# Altium project Breathalyzer.PrjPCB (part 2 of 2)
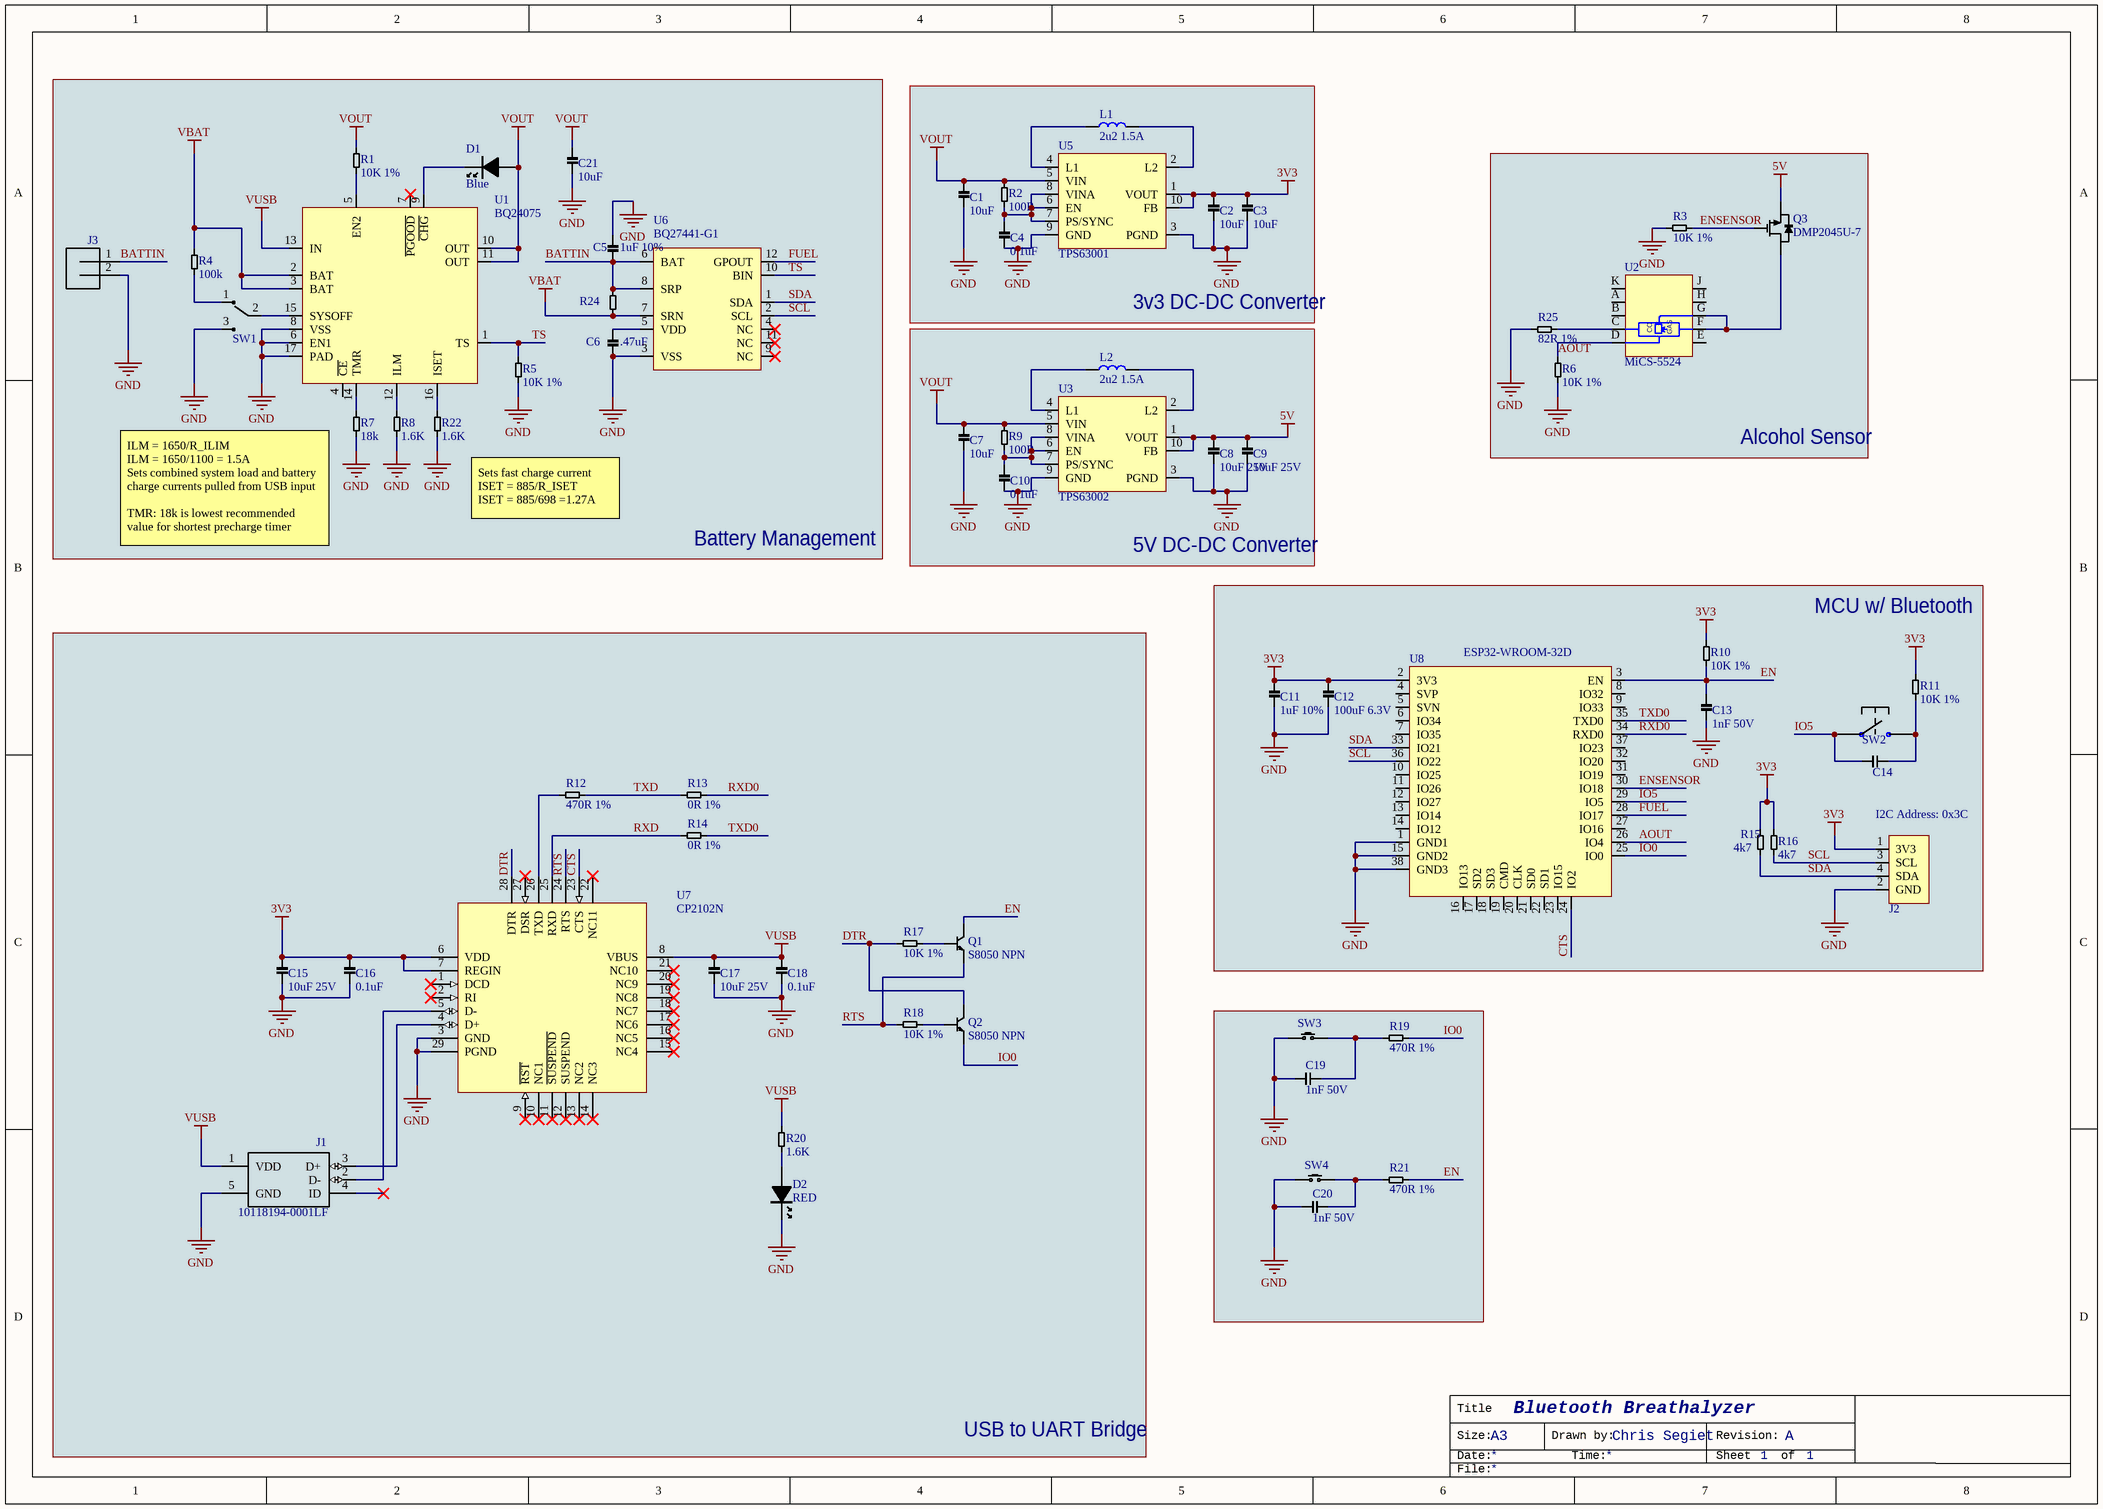
[diagram p1: Breathalyzer.SchDoc]

## Sheet Breathalyzer.SchDoc: Bluetooth Breathalyzer (continued)

### Library data of the parts
C1-C3 C7 C21 = 08056C106KAT2A: CAP CER 10UF 6.3V X7R 0805; Manufacturer: Kyocera AVX; Tolerance: 10%; Supplier 1: Digi-Key; Supplier Part Number 1: 478-5322-6-ND; Manufacturer Part Number: 08056C106KAT2A; Stock 1: 0; Pricing 1: 1=0.83, 10=0.614, 100=0.4209, 500=0.33322, 1000=0.2806 (USD); Mount: PCB,Surface Mount; Case/Package: 0805; Number of Pins: 2; Case Code (Imperial): 0805; Case Code (Metric): 2012; Contact Plating: Matte,Tin; Min Operating Temperature: -55°C; Max Operating Temperature: 125°C; Capacitance: 10uF; Voltage Rating: 6.3V; Packaging: Tape and Reel; Voltage Rating (DC): 6.3V; Package Quantity: 1; Dielectric: X7R; Termination: SMD/SMT; Voltage: 6.3V; Length: 2.01mm; Height: 1.52mm; Width: 0.049inch; Thickness: 0.055inch; Depth: 1.25mm; Radiation Hardening: No; REACH SVHC: No SVHC; Lead Free: Lead Free; ComponentLink1URL: http://www.farnell.com/datasheets/2095836.pdf; ComponentLink1Description: http://www.farnell.com/datasheets/2095836.pdf; ComponentLink2URL: http://avx.com/docs/Catalogs/cx7r.pdf; ComponentLink2Description: http://avx.com/docs/Catalogs/cx7r.pdf; ComponentLink3URL: http://www.mouser.com/ds/2/40/X7RDielectric-777024.pdf; ComponentLink3Description: http://www.mouser.com/ds/2/40/X7RDielectric-777024.pdf; ComponentLink4URL: https://www.verical.com/server-webapp/html/getDatasheet?partID=149687; ComponentLink4Description: https://www.verical.com/server-webapp/html/getDatasheet?partID=149687; ComponentLink5URL: http://www.avx.com/docs/catalogs/cx7r.pdf; ComponentLink5Description: http://www.avx.com/docs/catalogs/cx7r.pdf; ComponentLink6URL: http://catalogs.avx.com/SurfaceMount.pdf; ComponentLink6Description: http://catalogs.avx.com/SurfaceMount.pdf; ComponentLink7URL: http://datasheets.avx.com/X7RDielectric.pdf; ComponentLink7Description: http://datasheets.avx.com/X7RDielectric.pdf
C4 C10 C16 C18 = GRM188R71E104KA01D: CAP CER 0.1UF 25V X7R 0603; Manufacturer: Murata; Material: Ceramic; Capacitance: 100nF; Tolerance: 10%; Supplier 1: Digi-Key; Supplier Part Number 1: 490-1524-6-ND; Manufacturer Part Number: GRM188R71E104KA01D; Stock 1: 4000; Pricing 1: 1=0.13 (USD); Mount: Surface Mount; Case/Package: 0603; Number of Pins: 2; Weight: 7.1E-05oz; Case Code (Metric): 1608; Case Code (Imperial): 0603; Min Operating Temperature: -55°C; Max Operating Temperature: 125°C; Package Quantity: 1; Voltage Rating: 25V; Packaging: Tape and Reel; Voltage Rating (DC): 25V; Dielectric: X7R; Termination: SMD/SMT; Voltage: 25V; Length: 1.6mm; Height: 0.8mm; Width: 0.031inch; Thickness: 0.035inch; Depth: 0.8mm; Radiation Hardening: No; Lead Free: Lead Free; REACH SVHC: Unknown; ComponentLink1URL: https://www.murata.com/~/media/webrenewal/support/library/catalog/products/capacitor/mlcc/c02e.ashx?la=en-us; ComponentLink1Description: https://www.murata.com/~/media/webrenewal/support/library/catalog/products/capacitor/mlcc/c02e.ashx?la=en-us; ComponentLink2URL: http://psearch.en.murata.com/capacitor/product/GRM188R71E103KA01%23.pdf; ComponentLink2Description: http://psearch.en.murata.com/capacitor/product/GRM188R71E103KA01%23.pdf; ComponentLink3URL: http://www.farnell.com/datasheets/1747454.pdf; ComponentLink3Description: http://www.farnell.com/datasheets/1747454.pdf; ComponentLink4URL: http://www.jameco.com/Jameco/Products/ProdDS/1857495.pdf; ComponentLink4Description: http://www.jameco.com/Jameco/Products/ProdDS/1857495.pdf; ComponentLink5URL: https://www.verical.com/server-webapp/html/getDatasheet?partID=44549; ComponentLink5Description: https://www.verical.com/server-webapp/html/getDatasheet?partID=44549; ComponentLink6URL: https://produktinfo.conrad.com/datenblaetter/450000-474999/451555-da-01-en-VS_KONDENSATOR_0603.pdf; ComponentLink6Description: https://produktinfo.conrad.com/datenblaetter/450000-474999/451555-da-01-en-VS_KONDENSATOR_0603.pdf
C5 C11 = GRM188R61A105KA61J: Multilayer Ceramic Capacitors MLCC - SMD/SMT 0603 1uF 10volts X5R 10%; Manufacturer: Murata; Voltage Rating: 10V; Supplier 1: Digi-Key; Supplier Part Number 1: 490-6408-1-ND; Manufacturer Part Number: GRM188R61A105KA61J; Stock 1: 100000; Mount: Surface Mount; Case/Package: 0603; Case Code (Metric): 1608; Case Code (Imperial): 0603; Min Operating Temperature: -55°C; Max Operating Temperature: 85°C; Package Quantity: 1; Capacitance: 1uF; Tolerance: 10%; Packaging: Tape and Reel; Voltage Rating (DC): 10V; Dielectric: X5R; Termination: SMD/SMT; Length: 1.6mm; Height: 0.8mm; Width: 0.031inch; Thickness: 0.035inch; Depth: 0.8mm; Radiation Hardening: No; REACH SVHC: No SVHC; ComponentLink1URL: https://www.murata.com/~/media/webrenewal/support/library/catalog/products/capacitor/mlcc/c02e.ashx?la=en-us; ComponentLink1Description: https://www.murata.com/~/media/webrenewal/support/library/catalog/products/capacitor/mlcc/c02e.ashx?la=en-us
C6 = CC0805KKX7R8BB474: CAP CER 0.47UF 25V X7R 0805; Manufacturer: Yageo; Capacitance: 470nF; Tolerance: 10%; Dissipation Factor: 5%; Insulation Resistance: 10GR; Supplier 1: Digi-Key; Supplier Part Number 1: 311-1364-6-ND; Manufacturer Part Number: CC0805KKX7R8BB474; Stock 1: 0; Pricing 1: 1=0.29, 10=0.197, 100=0.0997, 500=0.06824, 1000=0.06037 (USD); Mount: Surface Mount; Case/Package: 0805; Number of Pins: 2; Case Code (Metric): 2012; Case Code (Imperial): 0805; Min Operating Temperature: -55°C; Max Operating Temperature: 125°C; Dielectric: X7R; Voltage: 25V; Packaging: Tape and Reel; Voltage Rating (DC): 25V; Package Quantity: 3000; Termination: SMD/SMT; Voltage Rating: 25V; Composition: Ceramic; Length: 2mm; Height: 1.25mm; Depth: 1.25mm; Width: 0.049inch; Thickness: 0.049inch; Radiation Hardening: No; Lead Free: Lead Free; Halogen Free: Halogen Free; REACH SVHC: No SVHC; ComponentLink1URL: http://documents.rs-components.com/techlib://itc_doclist_GB.htm?stockno=6963572; ComponentLink1Description: http://documents.rs-components.com/techlib://itc_doclist_GB.htm?stockno=6963572; ComponentLink2URL: http://www.farnell.com/datasheets/1489800.pdf; ComponentLink2Description: http://www.farnell.com/datasheets/1489800.pdf; ComponentLink3URL: http://www.yageo.com/documents/recent/UPY-GPHC_X7R_6.3V-to-50V_18.pdf; ComponentLink3Description: http://www.yageo.com/documents/recent/UPY-GPHC_X7R_6.3V-to-50V_18.pdf; ComponentLink4URL: https://www.verical.com/server-webapp/html/getDatasheet?partID=315216; ComponentLink4Description: https://www.verical.com/server-webapp/html/getDatasheet?partID=315216; ComponentLink5URL: http://www.mouser.com/ds/2/447/Yageo_UPY-GP_NP0_16V-to-50V_9-358835.pdf; ComponentLink5Description: http://www.mouser.com/ds/2/447/Yageo_UPY-GP_NP0_16V-to-50V_9-358835.pdf
C8 C9 C15 C17 = TMK316BJ106ML-T: CAP CER 10UF 25V X5R 1206; Manufacturer: Taiyo Yuden; Tolerance: 10%; Supplier 1: Digi-Key; Supplier Part Number 1: 587-2259-6-ND; Manufacturer Part Number: TMK316BJ106ML-T; Stock 1: 0; Pricing 1: 1=0.34, 10=0.236, 100=0.1339, 500=0.09454, 1000=0.08271 (USD); Mount: Surface Mount; Case/Package: 1206; Number of Pins: 2; Case Code (Imperial): 1206; Case Code (Metric): 3216; Contact Plating: Nickel; Min Operating Temperature: -55°C; Max Operating Temperature: 85°C; Capacitance: 10uF; Packaging: Tape and Reel; Voltage Rating: 25V; Package Quantity: 1; Voltage Rating (DC): 25V; Termination: SMD/SMT; Voltage: 25V; Dielectric: X5R; Composition: Ceramic; Length: 3.2mm; Height: 1.6mm; Width: 1.6mm; Depth: 1.6mm; Thickness: 0.071inch; Radiation Hardening: No; REACH SVHC: Unknown; Lead Free: Lead Free; Halogen Free: Halogen Free; ComponentLink1URL: https://www.yuden.co.jp/productdata/catalog/mlcc01_e.pdf; ComponentLink1Description: https://www.yuden.co.jp/productdata/catalog/mlcc01_e.pdf; ComponentLink2URL: http://www.farnell.com/datasheets/1481447.pdf; ComponentLink2Description: http://www.farnell.com/datasheets/1481447.pdf; ComponentLink3URL: http://www.farnell.com/datasheets/746258.pdf; ComponentLink3Description: http://www.farnell.com/datasheets/746258.pdf
C12 = GRM31CR60J107ME39K: Multilayer Ceramic Capacitors MLCC - SMD/SMT 1206 100uF 6.3volt X5R +/-20%; Manufacturer: Murata; Tolerance: 20%; Supplier 1: Digi-Key; Supplier Part Number 1: GRM31CR60J107ME39K-ND; Manufacturer Part Number: GRM31CR60J107ME39K; Stock 1: 0; Mount: Surface Mount; Case/Package: 1206; Case Code (Imperial): 1206; Case Code (Metric): 3216; Min Operating Temperature: -55°C; Max Operating Temperature: 85°C; Capacitance: 100uF; Packaging: Tape and Reel; Package Quantity: 1; Voltage Rating: 6.3V; Termination: SMD/SMT; Voltage Rating (DC): 6.3V; Dielectric: X5R; Voltage: 6.3V; Length: 3.2mm; Height: 1.6mm; Width: 0.063inch; Depth: 1.6mm; Thickness: 0.071inch; Radiation Hardening: No; REACH SVHC: No SVHC; Lead Free: Lead Free; ComponentLink1URL: http://www.mouser.com/ds/2/281/GRM31A7U2H471JW31-01-1064911.pdf; ComponentLink1Description: http://www.mouser.com/ds/2/281/GRM31A7U2H471JW31-01-1064911.pdf; ComponentLink2URL: https://www.murata.com/~/media/webrenewal/support/library/catalog/products/capacitor/mlcc/c02e.ashx?la=en-us; ComponentLink2Description: https://www.murata.com/~/media/webrenewal/support/library/catalog/products/capacitor/mlcc/c02e.ashx?la=en-us
C13 C14 C19 C20 = UMK107SD102KA-T: CAP CER 1000PF 50V 0603; Manufacturer: Taiyo Yuden; Dielectric Material: Ceramic; Tolerance: 10%; Supplier 1: Digi-Key; Supplier Part Number 1: 587-1070-6-ND; Manufacturer Part Number: UMK107SD102KA-T; Stock 1: 4000; Pricing 1: 1=0.36, 10=0.252, 100=0.1509, 500=0.1132, 1000=0.09559 (USD); Mount: Surface Mount; Case/Package: 0603; Number of Pins: 2; Case Code (Imperial): 0603; Case Code (Metric): 1608; Min Operating Temperature: -55°C; Max Operating Temperature: 125°C; Capacitance: 1nF; Packaging: Tape and Reel; Voltage Rating: 50V; Package Quantity: 1; Voltage Rating (DC): 50V; Termination: SMD/SMT; Voltage: 50V; Length: 1.6mm; Height: 0.8mm; Width: 0.8mm; Depth: 0.8mm; Thickness: 0.035inch; Radiation Hardening: No; Lead Free: Lead Free; Halogen Free: Halogen Free; ComponentLink1URL: http://www.yuden.co.jp/productdata/catalog/en/mlcc07_e.pdf; ComponentLink1Description: http://www.yuden.co.jp/productdata/catalog/en/mlcc07_e.pdf; ComponentLink2URL: http://documents.rs-components.com/techlib://itc_doclist_GB.htm?stockno=7587377; ComponentLink2Description: http://documents.rs-components.com/techlib://itc_doclist_GB.htm?stockno=7587377; ComponentLink3URL: http://ds.yuden.co.jp/TYCOMPAS/ut/detail.do?productNo=UMK107SD102KA-T&fileName=UMK107SD102KA-T_SS&mode=specSheetDownload; ComponentLink3Description: http://ds.yuden.co.jp/TYCOMPAS/ut/detail.do?productNo=UMK107SD102KA-T&fileName=UMK107SD102KA-T_SS&mode=specSheetDownload
D1 = LTST-C193TBKT-5A: Standard LEDs - SMD Blue 470nm 28mcd 5mA; Manufacturer: Vishay Lite-On; Lens Colour: Clear,Colorless; Forward Current: 20mA; Forward Voltage: 2.8V; Luminous Intensity: 15mcd; Viewing Angle: 130°; Lens Style: Clear,Colorless,Diffused,Rectangular; Dominant Wavelength: 475nm; Lens Transparency: Clear; Number of Elements: 1; Power Dissipation: 76mW; Reverse Voltage: 5V; Supplier 1: Mouser; Supplier Part Number 1: 859-LTSTC193TBKT5A; Manufacturer Part Number: LTST-C193TBKT-5A; Stock 1: 100531; Pricing 1: 1=0.43, 10=0.23, 50=0.23, 100=0.108, 1000=0.078, 10000=0.055 (USD); Mount: Surface Mount; Case/Package: 0603; Number of Pins: 2; Colour: Blue; Case Code (Metric): 1608; Case Code (Imperial): 0603; Min Operating Temperature: -20°C; Max Operating Temperature: 80°C; Package Quantity: 1; Packaging: Tape and Reel; Illumination Colour: Blue; Test Current: 5mA; Number of LEDs: 1; Length: 1.6mm; Height: 0.35mm; Width: 0.8mm; Depth: 0.8mm; Radiation Hardening: No; Lead Free: Lead Free; ComponentLink1URL: http://www.mouser.com/ds/2/239/Lite-On-LTST-C193TBKT-5A-187386.pdf; ComponentLink1Description: http://www.mouser.com/ds/2/239/Lite-On-LTST-C193TBKT-5A-187386.pdf; ComponentLink2URL: https://media.digikey.com/pdf/Data%20Sheets/Lite-On%20PDFs/LTST-C193TBKT-5A.pdf; ComponentLink2Description: https://media.digikey.com/pdf/Data%20Sheets/Lite-On%20PDFs/LTST-C193TBKT-5A.pdf; ComponentLink3URL: https://www.verical.com/server-webapp/html/getDatasheet?partID=293056; ComponentLink3Description: https://www.verical.com/server-webapp/html/getDatasheet?partID=293056; ComponentLink4URL: http://uk.rs-online.com/webdocs/0dc0/0900766b80dc0554.pdf; ComponentLink4Description: http://uk.rs-online.com/webdocs/0dc0/0900766b80dc0554.pdf; ComponentLink5URL: http://www1.futureelectronics.com/doc/LITE-ON/LTST-C193TBKT-5A.pdf; ComponentLink5Description: http://www1.futureelectronics.com/doc/LITE-ON/LTST-C193TBKT-5A.pdf
D2 = APT2012SRCPRV: LED 2X1.2MM 640NM RD WTR CLR SMD; Manufacturer: Kingbright; Lens Color: Clear; Forward Current: 20mA; Forward Voltage: 1.85V; Power Rating: 75mW; Luminous Intensity: 100mcd; Viewing Angle: 120°; Lens Style: Clear,Flat; Wavelength: 655nm; Number of LEDs: 1; Supplier 1: Mouser; Supplier Part Number 1: 604-APT2012SRCPRV; Manufacturer Part Number: APT2012SRCPRV; Stock 1: 64032; Pricing 1: 1=0.43, 10=0.266, 50=0.266, 100=0.128, 1000=0.082, 10000=0.053 (USD); Mount: Surface Mount; Case/Package: 0805; Number of Pins: 2; Color: Red; Case Code (Metric): 2012; Case Code (Imperial): 0805; Min Operating Temperature: -40°C; Max Operating Temperature: 85°C; Package Quantity: 2000; Illumination Color: Red; Packaging: Tape and Reel; Dominant Wavelength: 640nm; Test Current: 20mA; Length: 2mm; Height: 0.75mm; Width: 1.25mm; Lead Free: Lead Free; ComponentLink1URL: http://www.mouser.com/ds/2/216/APT2012SRCPRV-56885.pdf; ComponentLink1Description: http://www.mouser.com/ds/2/216/APT2012SRCPRV-56885.pdf; ComponentLink2URL: http://www.kingbrightusa.com/images/catalog/SPEC/APT2012SRCPRV.pdf; ComponentLink2Description: http://www.kingbrightusa.com/images/catalog/SPEC/APT2012SRCPRV.pdf; ComponentLink3URL: http://www.rapidonline.com/pdf/72-9588.pdf; ComponentLink3Description: http://www.rapidonline.com/pdf/72-9588.pdf
J1 = 10118194-0001LF: Conn Micro USB Type B RCP 5 POS 0.65mm Solder RA SMD 5 Terminal 1 Port T/R; MF: Amphenol FCI; Price: None; Package: None; SnapEDA_Link: https://www.snapeda.com/parts/10118194-0001LF/Amphenol%20ICC/view-part/?ref=snap; Availability: Unavailable; MP: 10118194-0001LF; Value: *
J2 = I2C Testing: 1x4 Header for I2C Testing
J3 = S2B-PH-SM4-TB: Socket; wire-board; male; PIN: 2; 2mm; SMT; PH; 100V; 2A; -25Ã·85Â°C; MF: JST; Package: None; MP: S2B-PH-SM4-TB; Price: None; Availability: Unavailable; SnapEDA_Link: https://www.snapeda.com/parts/S2B-PH-SM4-TB/JST/view-part/?ref=snap; Value: *
L1 L2 = VLF4012AT-2R2M1R5: FIXED IND 2.2UH 1.5A 87 MOHM SMD; Manufacturer: TDK; Core Material: Ferrite; Tolerance: 20%; Shielding: Shielded; DC Resistance (DCR): 87mR; Test Frequency: 100kHz; Supplier 1: Digi-Key; Supplier Part Number 1: 445-3233-1-ND; Manufacturer Part Number: VLF4012AT-2R2M1R5; Stock 1: 94427; Pricing 1: 1=0.83, 10=0.725, 100=0.5175, 500=0.4347 (USD); Mount: Surface Mount; Case/Package: Nonstandard; Number of Pins: 2; Min Operating Temperature: -40°C; Max Operating Temperature: 105°C; Packaging: Tape and Reel; Inductance Tolerance: 20%; Package Quantity: 1000; Current Rating: 1.5A; Saturation Current: 1.5A; Composition: Wirewound; Inductance: 2.2uh; Max DC Current: 1.5A; Termination: SMD/SMT; DC Current: 1.5A; Military Standard: Not; RMS Current (Irms): 1.5A; Length: 0.146inch; Height: 1.2mm; Width: 0.138inch; Height - Seated (Max): 0.047inch; Depth: 3.8mm; Radiation Hardening: No; REACH SVHC: No SVHC; Lead Free: Lead Free; ComponentLink1URL: http://www.farnell.com/datasheets/333336.pdf; ComponentLink1Description: http://www.farnell.com/datasheets/333336.pdf; ComponentLink2URL: http://www.onlinecomponents.com/productFiles/mf-TDK/e531_vlf4012a.pdf; ComponentLink2Description: http://www.onlinecomponents.com/productFiles/mf-TDK/e531_vlf4012a.pdf
Q1 Q2 = MMSS8050-L-TP: TRANS NPN 25V 1.5A SOT-23; Manufacturer: MCC; Max Power Dissipation: 625mW; hFE Min: 40; Collector Emitter Voltage (VCEO): 500mV; Transition Frequency: 100MHz; Collector Base Voltage (VCBO): 40V; Emitter Base Voltage (VEBO): 5V; Element Configuration: Single; Supplier 1: Digi-Key; Supplier Part Number 1: MMSS8050-L-TPMSDKR-ND; Manufacturer Part Number: MMSS8050-L-TP; Stock 1: 28424; Pricing 1: 1=0.21, 10=0.19, 25=0.1728, 100=0.1246, 250=0.07336, 500=0.0609, 1000=0.04152 (USD); Mount: Surface Mount; Case/Package: TO-236-3; Min Operating Temperature: -55°C; Max Operating Temperature: 150°C; Packaging: Tape and Reel; Package Quantity: 3000; Max Collector Current: 1.5A; Polarity: NPN; Collector Emitter Saturation Voltage: 500mV; Collector Emitter Breakdown Voltage: 25V; Gain Bandwidth Product: 100MHz; Max Breakdown Voltage: 25V; Lead Free: Lead Free; ComponentLink1URL: http://www.mccsemi.com/up_pdf/MMSS8050(SOT-23).pdf; ComponentLink1Description: http://www.mccsemi.com/up_pdf/MMSS8050(SOT-23).pdf; ComponentLink2URL: http://www.mouser.com/ds/2/258/MMSS8050(SOT-23)-276387.pdf; ComponentLink2Description: http://www.mouser.com/ds/2/258/MMSS8050(SOT-23)-276387.pdf
Q3 = DMP2045U-7: P-Channel MOSFET 045R at VGS=-4.5V ID = -4.3A; Manufacturer: Diodes; Supplier 1: Mouser; Supplier Part Number 1: 621-DMP2045U-7; Manufacturer Part Number: DMP2045U-7; Stock 1: 0; Pricing 1: 1=0.45, 10=0.289, 50=0.289, 100=0.124, 1000=0.095, 10000=0.064 (USD); ComponentLink1Description: Datasheet; ComponentLink1URL: https://www.diodes.com/assets/Datasheets/DMP2045U.pdf
R1 R3 R5 R6 R10 R11 R17 R18 = RC0805FR-0710KL: RES SMD 10K OHM 1% 1/8W 0805; Manufacturer: Yageo; Resistance: 10kR; Power Rating: 125mW; Voltage Rating: 150V; Temperature Coefficient: 100ppm/°C; Supplier 1: Digi-Key; Supplier Part Number 1: 311-10.0KCRDKR-ND; Manufacturer Part Number: RC0805FR-0710KL; Stock 1: 50767607; Pricing 1: 1=0.1, 10=0.046, 100=0.0186, 1000=0.00835, 2500=0.00725 (USD); Case/Package: 0805; Case Code (Imperial): 0805; Case Code (Metric): 2012; Min Operating Temperature: -55°C; Max Operating Temperature: 155°C; Packaging: Tape and Reel; Tolerance: 1%; Termination: SMD/SMT; Package Quantity: 1; Composition: Thick Film; Military Standard: Not; Max Power Dissipation: 125mW; Number of Terminations: 2; Features: Moisture Resistant; Length: 2mm; Height: 0.024inch; Depth: 1.25mm; Width: 0.049inch; REACH SVHC: Unknown; Lead Free: Lead Free; ComponentLink1URL: http://www.yageo.com/documents/recent/PYu-RC_Group_51_RoHS_L_9.pdf; ComponentLink1Description: http://www.yageo.com/documents/recent/PYu-RC_Group_51_RoHS_L_9.pdf; ComponentLink2URL: http://www.farnell.com/datasheets/444164.pdf; ComponentLink2Description: http://www.farnell.com/datasheets/444164.pdf; ComponentLink3URL: http://www.yageo.ru/pdf/RC0805.pdf; ComponentLink3Description: http://www.yageo.ru/pdf/RC0805.pdf
R2 R9 = RC0805JR-07100RL: RES, THICK FILM, 100R, 5%, 0.125W, 0805; Manufacturer: Yageo; Power Rating: 125mW; Voltage Rating: 150V; Temperature Coefficient: 100ppm/°C; Supplier 1: Mouser; Supplier Part Number 1: 603-RC0805JR-07100RL; Manufacturer Part Number: RC0805JR-07100RL; Stock 1: 497207; Pricing 1: 1=0.11, 10=0.026, 50=0.026, 100=0.009, 1000=0.007, 10000=0.004 (USD); Case/Package: 0805; Case Code (Imperial): 0805; Case Code (Metric): 2012; Contact Plating: Lead,Matte,Tin; Min Operating Temperature: -55°C; Max Operating Temperature: 155°C; Tolerance: 5%; Resistance: 100R; Packaging: Tape and Reel; Termination: SMD/SMT; Composition: Thick Film; Radiation Hardening: No; REACH SVHC: Unknown; Lead Free: Lead Free; ComponentLink1URL: http://www.farnell.com/datasheets/444164.pdf; ComponentLink1Description: http://www.farnell.com/datasheets/444164.pdf; ComponentLink2URL: http://www.farnell.com/datasheets/2167052.pdf; ComponentLink2Description: http://www.farnell.com/datasheets/2167052.pdf; ComponentLink3URL: http://www.farnell.com/datasheets/442941.pdf; ComponentLink3Description: http://www.farnell.com/datasheets/442941.pdf; ComponentLink4URL: http://www.yageo.ru/pdf/RC0805.pdf; ComponentLink4Description: http://www.yageo.ru/pdf/RC0805.pdf
R4 = RC0603FR-07100KL: YAGEO         RC0603FR-07100KL             RES, THICK FILM, 100K, 1%, 0.1W, 0603; Resistance: 100kR; Power Rating: 100mW; Voltage Rating: 50V; Temperature Coefficient: 100ppm/°C; Working Voltage: 75V; Supplier 1: Mouser; Supplier Part Number 1: 603-RC0603FR-07100KL; Manufacturer: Yageo; Manufacturer Part Number: RC0603FR-07100KL; Stock 1: 667937; Pricing 1: 1=0.1, 10=0.018, 50=0.018, 100=0.006, 1000=0.005, 10000=0.003 (USD); Case/Package: 0603; Number of Pins: 2; Case Code (Imperial): 0603; Case Code (Metric): 1608; Min Operating Temperature: -55°C; Max Operating Temperature: 155°C; Tolerance: 1%; Packaging: Tape and Reel; Termination: SMD/SMT; Composition: Thick Film; Military Standard: Not; Number of Terminations: 2; Voltage Rating (DC): 50V; Length: 1.6mm; Height: 0.45mm; Width: 0.8mm; Depth: 0.8mm; REACH SVHC: No SVHC; Lead Free: Lead Free; ComponentLink1URL: http://www.farnell.com/datasheets/2167052.pdf; ComponentLink1Description: http://www.farnell.com/datasheets/2167052.pdf; ComponentLink2URL: http://www.farnell.com/datasheets/1868787.pdf; ComponentLink2Description: http://www.farnell.com/datasheets/1868787.pdf; ComponentLink3URL: http://www.farnell.com/datasheets/1738695.pdf; ComponentLink3Description: http://www.farnell.com/datasheets/1738695.pdf; ComponentLink4URL: http://documents.rs-components.com/techlib://itc_doclist_GB.htm?stockno=5048940; ComponentLink4Description: http://documents.rs-components.com/techlib://itc_doclist_GB.htm?stockno=5048940; ComponentLink5URL: http://www.farnell.com/datasheets/443971.pdf; ComponentLink5Description: http://www.farnell.com/datasheets/443971.pdf
R7 = CRCW080518K0FKEA: RES SMD 18K OHM 1% 1/8W 0805; Manufacturer: Vishay; Resistance: 18kR; Power Rating: 125mW; Voltage Rating: 150V; Temperature Coefficient: 100ppm/°C; Supplier 1: Digi-Key; Supplier Part Number 1: 541-18.0KCDKR-ND; Manufacturer Part Number: CRCW080518K0FKEA; Stock 1: 0; Pricing 1: 1=0.1, 10=0.069, 100=0.028, 1000=0.01256, 2500=0.0109 (USD); Case/Package: 0805; Number of Pins: 2; Weight: 0.000194oz; Case Code (Metric): 2012; Case Code (Imperial): 0805; Contact Plating: Tin; Min Operating Temperature: -55°C; Max Operating Temperature: 155°C; Composition: Thick Film; Tolerance: 1%; Packaging: Tape and Reel; Number of Terminations: 2; Termination: SMD/SMT; Max Power Dissipation: 125mW; Voltage Rating (DC): 150V; Package Quantity: 10; Features: Automotive AEC-Q200; Military Standard: Not; Working Voltage: 150V; Length: 2mm; Height: 0.45mm; Depth: 1.25mm; Width: 0.049inch; Radiation Hardening: No; REACH SVHC: Unknown; Lead Free: Lead Free; ComponentLink1URL: http://www.vishay.com/docs/20035/dcrcwe3.pdf; ComponentLink1Description: http://www.vishay.com/docs/20035/dcrcwe3.pdf; ComponentLink2URL: https://www.distrelec.biz/Web/Downloads/a_/en/flD-CRCW-e3_data_en.pdf?mime=application%2Fpdf; ComponentLink2Description: https://www.distrelec.biz/Web/Downloads/a_/en/flD-CRCW-e3_data_en.pdf?mime=application%2Fpdf; ComponentLink3URL: http://www.farnell.com/datasheets/2046716.pdf; ComponentLink3Description: http://www.farnell.com/datasheets/2046716.pdf; ComponentLink4URL: http://www.alliedelec.com/m/d/0c934d6939ccefa68dbe0b96d821c8cf.pdf; ComponentLink4Description: http://www.alliedelec.com/m/d/0c934d6939ccefa68dbe0b96d821c8cf.pdf; ComponentLink5URL: http://uk.rs-online.com/webdocs/0d98/0900766b80d98b26.pdf; ComponentLink5Description: http://uk.rs-online.com/webdocs/0d98/0900766b80d98b26.pdf; ComponentLink6URL: http://www.mouser.com/ds/2/427/dcrcwe3-109170.pdf; ComponentLink6Description: http://www.mouser.com/ds/2/427/dcrcwe3-109170.pdf
R8 R20 R22 = CRCW08051K60FKEA: RES SMD 1.6K OHM 1% 1/8W 0805; Manufacturer: Vishay; Resistance: 1.6kR; Power Rating: 125mW; Voltage Rating: 150V; Temperature Coefficient: 100ppm/°C; Supplier 1: Digi-Key; Supplier Part Number 1: 541-1.60KCDKR-ND; Manufacturer Part Number: CRCW08051K60FKEA; Stock 1: 12623; Pricing 1: 1=0.1, 10=0.069, 100=0.028, 1000=0.01256, 2500=0.0109 (USD); Case/Package: 0805; Number of Pins: 2; Weight: 0.000194oz; Case Code (Metric): 2012; Case Code (Imperial): 0805; Contact Plating: Tin; Min Operating Temperature: -55°C; Max Operating Temperature: 155°C; Composition: Thick Film; Tolerance: 1%; Packaging: Tape and Reel; Termination: SMD/SMT; Package Quantity: 5000; Number of Terminations: 2; Max Power Dissipation: 125mW; Voltage Rating (DC): 150V; Military Standard: Not; Features: Automotive AEC-Q200; Length: 2mm; Height: 0.45mm; Width: 0.049inch; Depth: 1.25mm; Radiation Hardening: No; Lead Free: Lead Free; REACH SVHC: Unknown; ComponentLink1URL: http://www.vishay.com/docs/20035/dcrcwe3.pdf; ComponentLink1Description: http://www.vishay.com/docs/20035/dcrcwe3.pdf; ComponentLink2URL: http://uk.rs-online.com/webdocs/0d98/0900766b80d98b26.pdf; ComponentLink2Description: http://uk.rs-online.com/webdocs/0d98/0900766b80d98b26.pdf; ComponentLink3URL: http://www.mouser.com/ds/2/427/dcrcwe3-109170.pdf; ComponentLink3Description: http://www.mouser.com/ds/2/427/dcrcwe3-109170.pdf; ComponentLink4URL: http://www.farnell.com/datasheets/2111203.pdf; ComponentLink4Description: http://www.farnell.com/datasheets/2111203.pdf; ComponentLink5URL: http://www.farnell.com/datasheets/2046716.pdf; ComponentLink5Description: http://www.farnell.com/datasheets/2046716.pdf; ComponentLink6URL: http://www.farnell.com/datasheets/1847332.pdf; ComponentLink6Description: http://www.farnell.com/datasheets/1847332.pdf; ComponentLink7URL: http://www.farnell.com/datasheets/1697337.pdf; ComponentLink7Description: http://www.farnell.com/datasheets/1697337.pdf; ComponentLink8URL: https://www.distrelec.biz/Web/Downloads/a_/en/flD-CRCW-e3_data_en.pdf?mime=application%2Fpdf; ComponentLink8Description: https://www.distrelec.biz/Web/Downloads/a_/en/flD-CRCW-e3_data_en.pdf?mime=application%2Fpdf
R12 R19 R21 = RC0805FR-07470RL: RES SMD 470 OHM 1% 1/8W 0805; Manufacturer: Yageo; Power Rating: 125mW; Voltage Rating: 150V; Temperature Coefficient: 100ppm/°C; Supplier 1: Digi-Key; Supplier Part Number 1: 311-470CRDKR-ND; Manufacturer Part Number: RC0805FR-07470RL; Stock 1: 2436062; Pricing 1: 1=0.1, 10=0.046, 100=0.0186, 1000=0.00835, 2500=0.00725 (USD); Case/Package: 0805; Number of Pins: 2; Case Code (Metric): 2012; Case Code (Imperial): 0805; Min Operating Temperature: -55°C; Max Operating Temperature: 155°C; Resistance: 470R; Tolerance: 1%; Packaging: Tape and Reel; Composition: Thick Film; Voltage Rating (DC): 150V; Military Standard: Not; Max Power Dissipation: 125mW; Package Quantity: 1; Termination: SMD/SMT; Number of Terminations: 2; Features: Moisture Resistant; Length: 2mm; Height: 0.5mm; Depth: 1.25mm; Width: 1.25mm; Lead Pitch: 0.4mm; REACH SVHC: Unknown; Lead Free: Lead Free; ComponentLink1URL: http://www.yageo.com/documents/recent/PYu-RC_Group_51_RoHS_L_9.pdf; ComponentLink1Description: http://www.yageo.com/documents/recent/PYu-RC_Group_51_RoHS_L_9.pdf; ComponentLink2URL: http://www.farnell.com/datasheets/444164.pdf; ComponentLink2Description: http://www.farnell.com/datasheets/444164.pdf; ComponentLink3URL: http://documents.rs-components.com/techlib://itc_doclist_GB.htm?stockno=6182546; ComponentLink3Description: http://documents.rs-components.com/techlib://itc_doclist_GB.htm?stockno=6182546; ComponentLink4URL: http://www.yageo.ru/pdf/RC0805.pdf; ComponentLink4Description: http://www.yageo.ru/pdf/RC0805.pdf
R13 R14 = RC0603FR-070RL: Thick Film Resistors - SMD 0.0ohm 1%; Manufacturer: Yageo; Resistance: 0mR; Power Rating: 100mW; Voltage Rating: 50V; Temperature Coefficient: 200ppm/°C; Current Rating: 1A; Working Voltage: 75V; Supplier 1: Mouser; Supplier Part Number 1: 311-0.0HRCT-ND; Manufacturer Part Number: RC0603FR-070RL; Stock 1: 0; Case/Package: 0603; Number of Pins: 2; Case Code (Metric): 1608; Case Code (Imperial): 0603; Contact Plating: Matte,Tin; Min Operating Temperature: -55°C; Max Operating Temperature: 155°C; Packaging: Tape and Reel; Tolerance: 1%; Composition: Thick Film; Voltage Rating (DC): 50V; Package Quantity: 5000; Military Standard: Not; Termination: SMD/SMT; Number of Terminations: 2; Max Power Dissipation: 100mW; Features: Moisture Resistant; Length: 1.6mm; Height: 0.45mm; Width: 0.031inch; Depth: 0.8mm; Radiation Hardening: No; REACH SVHC: No SVHC; Lead Free: Lead Free; ComponentLink1URL: http://www.farnell.com/datasheets/1868787.pdf; ComponentLink1Description: http://www.farnell.com/datasheets/1868787.pdf; ComponentLink2URL: http://www.farnell.com/datasheets/443971.pdf; ComponentLink2Description: http://www.farnell.com/datasheets/443971.pdf; ComponentLink3URL: http://www.yageo.com/documents/recent/PYu-RC_Group_51_RoHS_L_9.pdf; ComponentLink3Description: http://www.yageo.com/documents/recent/PYu-RC_Group_51_RoHS_L_9.pdf; ComponentLink4URL: http://documents.rs-components.com/techlib://itc_doclist_GB.htm?stockno=5048827; ComponentLink4Description: http://documents.rs-components.com/techlib://itc_doclist_GB.htm?stockno=5048827
R15 R16 = RC0805JR-074K7L: YAGEO         RC0805JR-074K7L             RES, THICK FILM, 4K7, 5%, 0.125W, 0805; Resistance: 4.7kR; Temperature Coefficient: 100ppm/°C; Power Rating: 125mW; Voltage Rating: 150V; Supplier 1: Digi-Key; Supplier Part Number 1: 311-4.7KARDKR-ND; Manufacturer: Yageo; Manufacturer Part Number: RC0805JR-074K7L; Stock 1: 4671769; Pricing 1: 1=0.1, 10=0.036, 100=0.0146, 1000=0.00654, 2500=0.00568 (USD); Case/Package: Molded; Contact Plating: Lead,Matte,Tin; Case Code (Imperial): 0805; Case Code (Metric): 2012; Min Operating Temperature: -55°C; Max Operating Temperature: 155°C; Tolerance: 5%; Packaging: Tape and Reel; Composition: Thick Film; Termination: SMD/SMT; Military Standard: Not; Length: 2mm; Depth: 1.25mm; Radiation Hardening: No; REACH SVHC: Unknown; Lead Free: Lead Free; ComponentLink1URL: http://www.farnell.com/datasheets/442941.pdf; ComponentLink1Description: http://www.farnell.com/datasheets/442941.pdf; ComponentLink2URL: http://www.yageo.ru/pdf/RC0805.pdf; ComponentLink2Description: http://www.yageo.ru/pdf/RC0805.pdf; ComponentLink3URL: http://www.mouser.com/ds/2/447/Yageo_08112016_RC0805-968729.pdf; ComponentLink3Description: http://www.mouser.com/ds/2/447/Yageo_08112016_RC0805-968729.pdf
R24 = ERJ-8BWFR010V: Current Sense Resistor, 0.01 ohm, 1206 [3216 Metric], 1 W,  1%, ERJ8B Series; Manufacturer: Panasonic; Resistance: 10mR; Temperature Coefficient: 200ppm/°C; Supplier 1: Digi-Key; Supplier Part Number 1: P.010AUDKR-ND; Manufacturer Part Number: ERJ-8BWFR010V; Stock 1: 131309; Pricing 1: 1=0.74, 10=0.618, 100=0.4148, 1000=0.2427, 2500=0.23475 (USD); Mount: Surface Mount; Case/Package: 1206; Case Code (Imperial): 1206; Case Code (Metric): 3216; Contact Plating: Tin; Min Operating Temperature: -55°C; Max Operating Temperature: 155°C; Power Rating: 1W; Tolerance: 1%; Packaging: Tape and Reel; Package Quantity: 1; Composition: Low-Ohm-Resistor,Thick Film; Termination: SMD/SMT; Military Standard: Not; Number of Terminations: 2; Max Power Dissipation: 1W; Features: Automotive AEC-Q200; Length: 3.2mm; Height: 0.65mm; Width: 1.6mm; Depth: 1.6mm; Radiation Hardening: No; REACH SVHC: No SVHC; Lead Free: Lead Free; ComponentLink1URL: http://uk.rs-online.com/webdocs/13b8/0900766b813b869e.pdf; ComponentLink1Description: http://uk.rs-online.com/webdocs/13b8/0900766b813b869e.pdf; ComponentLink2URL: http://industrial.panasonic.com/www-data/pdf/AOA0000/AOA0000CE3.pdf; ComponentLink2Description: http://industrial.panasonic.com/www-data/pdf/AOA0000/AOA0000CE3.pdf; ComponentLink3URL: https://www.distrelec.biz/Web/Downloads/_t/ds/ERJ_eng_tds.pdf?mime=application%2Fpdf; ComponentLink3Description: https://www.distrelec.biz/Web/Downloads/_t/ds/ERJ_eng_tds.pdf?mime=application%2Fpdf; ComponentLink4URL: https://industrial.panasonic.com/cdbs/www-data/pdf/RDN0000/AOA0000C313.pdf; ComponentLink4Description: https://industrial.panasonic.com/cdbs/www-data/pdf/RDN0000/AOA0000C313.pdf; ComponentLink5URL: http://www.farnell.com/datasheets/39793.pdf; ComponentLink5Description: http://www.farnell.com/datasheets/39793.pdf
R25 = CRCW080582R0FKEA: RES SMD 82 OHM 1% 1/8W 0805; Manufacturer: Vishay; Power Rating: 125mW; Voltage Rating: 150V; Temperature Coefficient: 100ppm/°C; Supplier 1: Digi-Key; Supplier Part Number 1: 541-82.0CDKR-ND; Manufacturer Part Number: CRCW080582R0FKEA; Stock 1: 0; Pricing 1: 1=0.1, 10=0.069, 100=0.028, 1000=0.01256, 2500=0.0109 (USD); Case/Package: 0805; Number of Pins: 2; Weight: 0.000194oz; Case Code (Metric): 2012; Case Code (Imperial): 0805; Contact Plating: Tin; Min Operating Temperature: -55°C; Max Operating Temperature: 155°C; Composition: Thick Film; Resistance: 82R; Tolerance: 1%; Packaging: Tape and Reel; Termination: SMD/SMT; Package Quantity: 10; Number of Terminations: 2; Max Power Dissipation: 125mW; Voltage Rating (DC): 150V; Military Standard: Not; Features: Automotive AEC-Q200; Length: 2mm; Height: 0.45mm; Width: 0.049inch; Depth: 1.25mm; Radiation Hardening: No; REACH SVHC: Unknown; Lead Free: Lead Free; ComponentLink1URL: http://www.vishay.com/docs/20035/dcrcwe3.pdf; ComponentLink1Description: http://www.vishay.com/docs/20035/dcrcwe3.pdf; ComponentLink2URL: https://www.alliedelec.com/m/d/0c934d6939ccefa68dbe0b96d821c8cf.pdf; ComponentLink2Description: https://www.alliedelec.com/m/d/0c934d6939ccefa68dbe0b96d821c8cf.pdf; ComponentLink3URL: http://www.farnell.com/datasheets/1697337.pdf; ComponentLink3Description: http://www.farnell.com/datasheets/1697337.pdf; ComponentLink4URL: http://www.farnell.com/datasheets/2111203.pdf; ComponentLink4Description: http://www.farnell.com/datasheets/2111203.pdf; ComponentLink5URL: http://www.farnell.com/datasheets/2046716.pdf; ComponentLink5Description: http://www.farnell.com/datasheets/2046716.pdf; ComponentLink6URL: https://www.distrelec.biz/Web/Downloads/a_/en/flD-CRCW-e3_data_en.pdf?mime=application%2Fpdf; ComponentLink6Description: https://www.distrelec.biz/Web/Downloads/a_/en/flD-CRCW-e3_data_en.pdf?mime=application%2Fpdf; ComponentLink7URL: http://www.mouser.com/ds/2/427/dcrcwe3-109170.pdf; ComponentLink7Description: http://www.mouser.com/ds/2/427/dcrcwe3-109170.pdf; ComponentLink8URL: http://uk.rs-online.com/webdocs/0d98/0900766b80d98b26.pdf; ComponentLink8Description: http://uk.rs-online.com/webdocs/0d98/0900766b80d98b26.pdf
SW1 = PCM12SMTR: C & K COMPONENTS         PCM12SMTR             Slide Switch, SPDT, On-On, SMD, PCM Series, 300 mA; Manufacturer: ITT C&K; Mechanical Life: 10000Cycles; Actuator Material: Nylon,Polyamide; Voltage Rating (AC): 6V; Contact Resistance: 70mR; Max Current Rating: 300mA; Insulation Resistance: 100mR; Switch Travel: 1.5mm; Actuator Type: Standard; Supplier 1: Mouser; Supplier Part Number 1: 611-PCM12SMTR; Manufacturer Part Number: PCM12SMTR; Stock 1: 22229; Pricing 1: 1=0.87, 10=0.83, 50=0.762, 100=0.726, 1000=0.581, 10000=0.528 (USD); Mount: Surface Mount; Contact Material: Copper,Copper Alloy,Silver; Contact Plating: Silver; Min Operating Temperature: -20°C; Max Operating Temperature: 85°C; Package Quantity: 1; Packaging: Tape and Reel; Throw Configuration: SPDT; Voltage Rating (DC): 6V; Max Voltage Rating (DC): 6V; Contact Current Rating: 300mA; Current Rating: 300mA; Termination: Gull Wing; Orientation: Right Angle; Switch Function: On-On; Length: 7.7mm; Width: 6.7mm; Depth: 5mm; Actuator Length: 1.5mm; REACH SVHC: No SVHC; Lead Free: Lead Free; ComponentLink1URL: https://www.ckswitches.com/media/1424/pcm.pdf; ComponentLink1Description: https://www.ckswitches.com/media/1424/pcm.pdf; ComponentLink2URL: https://products.avnet.com/shop/en/asia/switches-and-relays/switches/slide-switch/www.ckswitches.com/media/1424/pcm.pdf; ComponentLink2Description: https://products.avnet.com/shop/en/asia/switches-and-relays/switches/slide-switch/www.ckswitches.com/media/1424/pcm.pdf; ComponentLink3URL: http://www1.futureelectronics.com/doc/C%20&%20K%20COMPONENTS/PCM12SMTR.pdf; ComponentLink3Description: http://www1.futureelectronics.com/doc/C%20&%20K%20COMPONENTS/PCM12SMTR.pdf; ComponentLink4URL: http://www.farnell.com/datasheets/1789487.pdf; ComponentLink4Description: http://www.farnell.com/datasheets/1789487.pdf
SW2 = PTS645SM43SMTR: Switch Tact 6mm 100gf h=4.3mm; MF: C&K; SnapEDA_Link: https://www.snapeda.com/parts/PTS645SM43SMTR/C%26K/view-part/?ref=snap; Availability: Unavailable; Package: None; Price: None; MP: PTS645SM43SMTR; Value: *
SW3 SW4 = EVPAWCD4A: Tactile Switch; Manufacturer: Panasonic; Supplier 1: Digikey; Supplier Part Number 1: P123439CT-ND; Manufacturer Part Number: EVPAWCD4A; Stock 1: 19414; Pricing 1: 1=0.3, 10=0.289, 25=0.2788, 50=0.2686, 100=0.2582, 250=0.23756, 500=0.20658, 1000=0.17559, 5000=0.14719 (USD); ComponentLink1URL: http://datasheet.octopart.com/EVPAWCD4A-Panasonic-datasheet-96186218.pdf; ComponentLink1Description: http://datasheet.octopart.com/EVPAWCD4A-Panasonic-datasheet-96186218.pdf
U1 = BQ24075RGTT: TEXAS INSTRUMENTS   BQ24075RGTT   IC, BATTERY CHARGER,LI-ION, 1.5A, QFN-16; Output Voltage: 4.2V; Max Supply Voltage: 6.4V; Number of Cells: 1; Min Supply Voltage: 4.35V; Min Input Voltage: 4.3V; Max Output Current: 4.5A; Max Output Voltage: 5.6V; Min Output Voltage: 5.4V; Max Input Voltage: 26V; Supplier 1: Mouser; Supplier Part Number 1: 595-BQ24075RGTT; Manufacturer: Texas Instruments; Manufacturer Part Number: BQ24075RGTT; Stock 1: 2131; Pricing 1: 1=2.59, 10=2.2, 50=2.2, 100=1.76, 1000=1.28, 10000=1.15 (USD); Case/Package: QFN; Number of Pins: 16; Weight: 0.000808oz; Contact Plating: Gold; Min Operating Temperature: -40°C; Max Operating Temperature: 85°C; Package Quantity: 1; Output Current: 1.5A; Packaging: Tape and Reel; Max Charge Current: 1.5A; Termination: SMD/SMT; Length: 3.15mm; Height: 0.95mm; Width: 3.15mm; Radiation Hardening: No; Lead Free: Lead Free; REACH SVHC: No SVHC; ComponentLink1URL: https://www.verical.com/server-webapp/html/getDatasheet?partID=313264; ComponentLink1Description: https://www.verical.com/server-webapp/html/getDatasheet?partID=313264; ComponentLink2URL: http://www.ti.com/lit/gpn/bq24075; ComponentLink2Description: http://www.ti.com/lit/gpn/bq24075; ComponentLink3URL: http://www.farnell.com/datasheets/1885912.pdf; ComponentLink3Description: http://www.farnell.com/datasheets/1885912.pdf; ComponentLink4URL: http://www.farnell.com/datasheets/2001589.pdf; ComponentLink4Description: http://www.farnell.com/datasheets/2001589.pdf; ComponentLink5URL: http://www.ti.com/lit/ds/symlink/bq24079.pdf; ComponentLink5Description: http://www.ti.com/lit/ds/symlink/bq24079.pdf; ComponentLink6URL: http://www.ti.com/general/docs/lit/getliterature.tsp?genericPartNumber=BQ24079&&fileType=pdf; ComponentLink6Description: http://www.ti.com/general/docs/lit/getliterature.tsp?genericPartNumber=BQ24079&&fileType=pdf; ComponentLink7URL: http://datasheet.iiic.cc/texas_instruments/BQ24075RGTT.pdf; ComponentLink7Description: http://datasheet.iiic.cc/texas_instruments/BQ24075RGTT.pdf
U2 = MiCS-5524: 10-500ppm Ethanol Sensor; Manufacturer: Amphenol SGX Sensortech; Supply Voltage Min: 4.9V; Supply Voltage Max: 5.1V; Current Rating: 32mA; Carbon monoxide range: 1-1000ppm; Ammonia range: 1-500ppm; Methane range: >1000ppm; Sensing resistance in air (R_0): 100 to 1500R; Heating power: 76mW typ, 71mW min, 81mW max; Heating voltage: 2.4V; Heating resistance at nominal power: 74R typ, 66R min, 82R max; Max heater power dissipation: 88mW; Max sensitive layer power dissipation: 8mW; Relative humidity range: 5-95%RH; ComponentLink1Description: Hook-up Guide; ComponentLink1URL: https://learn.adafruit.com/adafruit-mics5524-gas-sensor-breakout/overview; ComponentLink2Description: Manufacturer; ComponentLink2URL: https://sgx.cdistore.com/Products/Detail/MICS5524-SGX-Sensortech/333420/; Category: Air Quality Sensors; Series: MICS; Minimum Operating Temp: -30C; Maximum Operating Temp: +85C; Mounting Style: SMD; Ethanol range: 10-500ppm; Hydrogen range: 1-1000ppm; Storage temperature range: -40 to 120C; Supplier 1: Mouser; Supplier Part Number 1: 523-MICS-5524; ComponentLink3Description: Datasheet; ComponentLink3URL: https://www.mouser.com/datasheet/2/18/1084_Datasheet-MiCS-5524-rev-8-1144838.pdf
U3 = TPS63002DRCR: IC REG BUCK BOOST 5V 1.6A 10SON; Manufacturer: Texas Instruments; Number of Outputs: 1; Output Current: 1.2A; Efficiency: 96%; Switching Frequency: 1.5MHz; Max Input Voltage: 5.5V; Min Input Voltage: 1.8V; Synchronous Rectifier: Yes; Quiescent Current: 30uA; Topology: Buck-Boost; Output Type: Fixed; Supplier 1: Mouser; Supplier Part Number 1: 595-TPS63002DRCR; Manufacturer Part Number: TPS63002DRCR; Stock 1: 3675; Pricing 1: 1=2.2, 10=1.87, 50=1.87, 100=1.5, 1000=1.09, 10000=0.973 (USD); Number of Pins: 10; Weight: 0.000921oz; Contact Plating: Gold; Min Operating Temperature: -40°C; Max Operating Temperature: 85°C; Output Voltage: 5V; Packaging: Tape and Reel; Package Quantity: 1; Nominal Output Voltage: 5V; Max Output Current: 1.2A; Max Output Voltage: 5V; Min Output Voltage: 5V; Operating Supply Voltage: 5.5V; Radiation Hardening: No; REACH SVHC: No SVHC; Lead Free: Lead Free; ComponentLink1URL: http://www.farnell.com/datasheets/1854797.pdf; ComponentLink1Description: http://www.farnell.com/datasheets/1854797.pdf; ComponentLink2URL: http://www.ti.com/lit/ds/symlink/tps63001.pdf; ComponentLink2Description: http://www.ti.com/lit/ds/symlink/tps63001.pdf; ComponentLink3URL: http://focus.ti.com/lit/ds/symlink/tps63001.pdf; ComponentLink3Description: http://focus.ti.com/lit/ds/symlink/tps63001.pdf; ComponentLink4URL: http://www.ti.com/general/docs/lit/getliterature.tsp?genericPartNumber=TPS63002&&fileType=pdf; ComponentLink4Description: http://www.ti.com/general/docs/lit/getliterature.tsp?genericPartNumber=TPS63002&&fileType=pdf
U5 = TPS63001DRCT: Conv DC-DC Single Non-Inv/Inv/Step Up/Step Down 1.8V to 5.5V 10-Pin VSON EP T/R; Manufacturer: Texas Instruments; Number of Outputs: 1; Output Voltage: 3.3V; Efficiency: 96%; Output Current: 1.2A; Switching Frequency: 1.5MHz; Synchronous Rectifier: Yes; Quiescent Current: 30uA; Topology: Buck-Boost; Output Type: Fixed; Output Configuration: Positive; Supplier 1: Mouser; Supplier Part Number 1: 595-TPS63001DRCT; Manufacturer Part Number: TPS63001DRCT; Stock 1: 4204; Pricing 1: 1=2.53, 10=2.15, 50=2.15, 100=1.73, 1000=1.25, 10000=1.12 (USD); Number of Pins: 10; Weight: 0.000921oz; Contact Plating: Gold; Min Operating Temperature: -40°C; Max Operating Temperature: 85°C; Packaging: Tape and Reel; Package Quantity: 250; Max Output Current: 1.2A; Max Input Voltage: 5.5V; Min Input Voltage: 1.8V; Min Output Voltage: 3.3V; Max Output Voltage: 3.3V; Nominal Output Voltage: 3.3V; Frequency: 1.5MHz; Min Supply Voltage: 1.8V; Max Supply Voltage: 5.5V; Termination: SMD/SMT; Length: 3mm; Height: 0.9mm; Width: 3mm; Radiation Hardening: No; REACH SVHC: No SVHC; Lead Free: Lead Free; ComponentLink1URL: http://www.ti.com/lit/ds/symlink/tps63001.pdf; ComponentLink1Description: http://www.ti.com/lit/ds/symlink/tps63001.pdf; ComponentLink2URL: http://www.farnell.com/datasheets/1764456.pdf; ComponentLink2Description: http://www.farnell.com/datasheets/1764456.pdf; ComponentLink3URL: http://www.ti.com/general/docs/lit/getliterature.tsp?genericPartNumber=TPS63002&&fileType=pdf; ComponentLink3Description: http://www.ti.com/general/docs/lit/getliterature.tsp?genericPartNumber=TPS63002&&fileType=pdf; ComponentLink4URL: https://www.verical.com/server-webapp/html/getDatasheet?partID=188363; ComponentLink4Description: https://www.verical.com/server-webapp/html/getDatasheet?partID=188363
U6 = BQ27441DRZR-G1A: IC BATT FUEL GAUGE LI-ION 12SON; Manufacturer: Texas Instruments; Number of Cells: 1; Interface: I2C; Capacity: 8000mAh; Output Voltage: 600mV; Output Current: 500uA; Operating Supply Voltage: 4.5V; Supplier 1: Mouser; Supplier Part Number 1: 595-BQ27441DRZR-G1A; Manufacturer Part Number: BQ27441DRZR-G1A; Stock 1: 12994; Pricing 1: 1=2.54, 10=2.16, 50=2.16, 100=1.73, 1000=1.25, 10000=1.13 (USD); Mount: Surface Mount; Case/Package: QFN; Number of Pins: 12; Contact Plating: Gold; Min Operating Temperature: -40°C; Max Operating Temperature: 85°C; Package Quantity: 3000; Packaging: Tape and Reel; Lead Free: Lead Free; ComponentLink1Description: Datasheet; ComponentLink1URL: http://www.ti.com/lit/ds/symlink/bq27441-g1.pdf
U7 = CP2102N-A01-GQFN28: SILICON LABS         CP2102N-A01-GQFN28             Interface Bridges, USB to UART, 3 V, 3.6 V, QFN, 28 Pins, -40 C                          New; Min Supply Voltage: 3V; Max Supply Voltage: 3.6V; Supplier 1: Digi-Key; Supplier Part Number 1: 336-3694-ND; Manufacturer: Silicon Labs; Manufacturer Part Number: CP2102N-A01-GQFN28; Stock 1: 15372; Pricing 1: 1=1.4, 25=1.3516, 100=1.2995, 1000=1.22501 (USD); Case/Package: QFN; Number of Pins: 28; Min Operating Temperature: -40°C; Max Operating Temperature: 85°C; REACH SVHC: Unknown
U8 = ESP32-WROOM-32D: ESP32 Module; Manufacturer: Espressif Systems; Supplier 1: Mouser; Supplier Part Number 1: 356-ESP32WROOM-32D; Manufacturer Part Number: ESP32-WROOM-32D; Stock 1: 1150; Pricing 1: 1=3.8, 10=3.8, 50=3.8, 100=3.8, 1000=3.8, 10000=3.8 (USD); ComponentLink1Description: Datasheet; ComponentLink1URL: https://www.mouser.com/datasheet/2/891/esp32-wroom-32d_esp32-wroom-32u_datasheet_en-1365844.pdf